# Altium project PCB_Project.PrjPcb
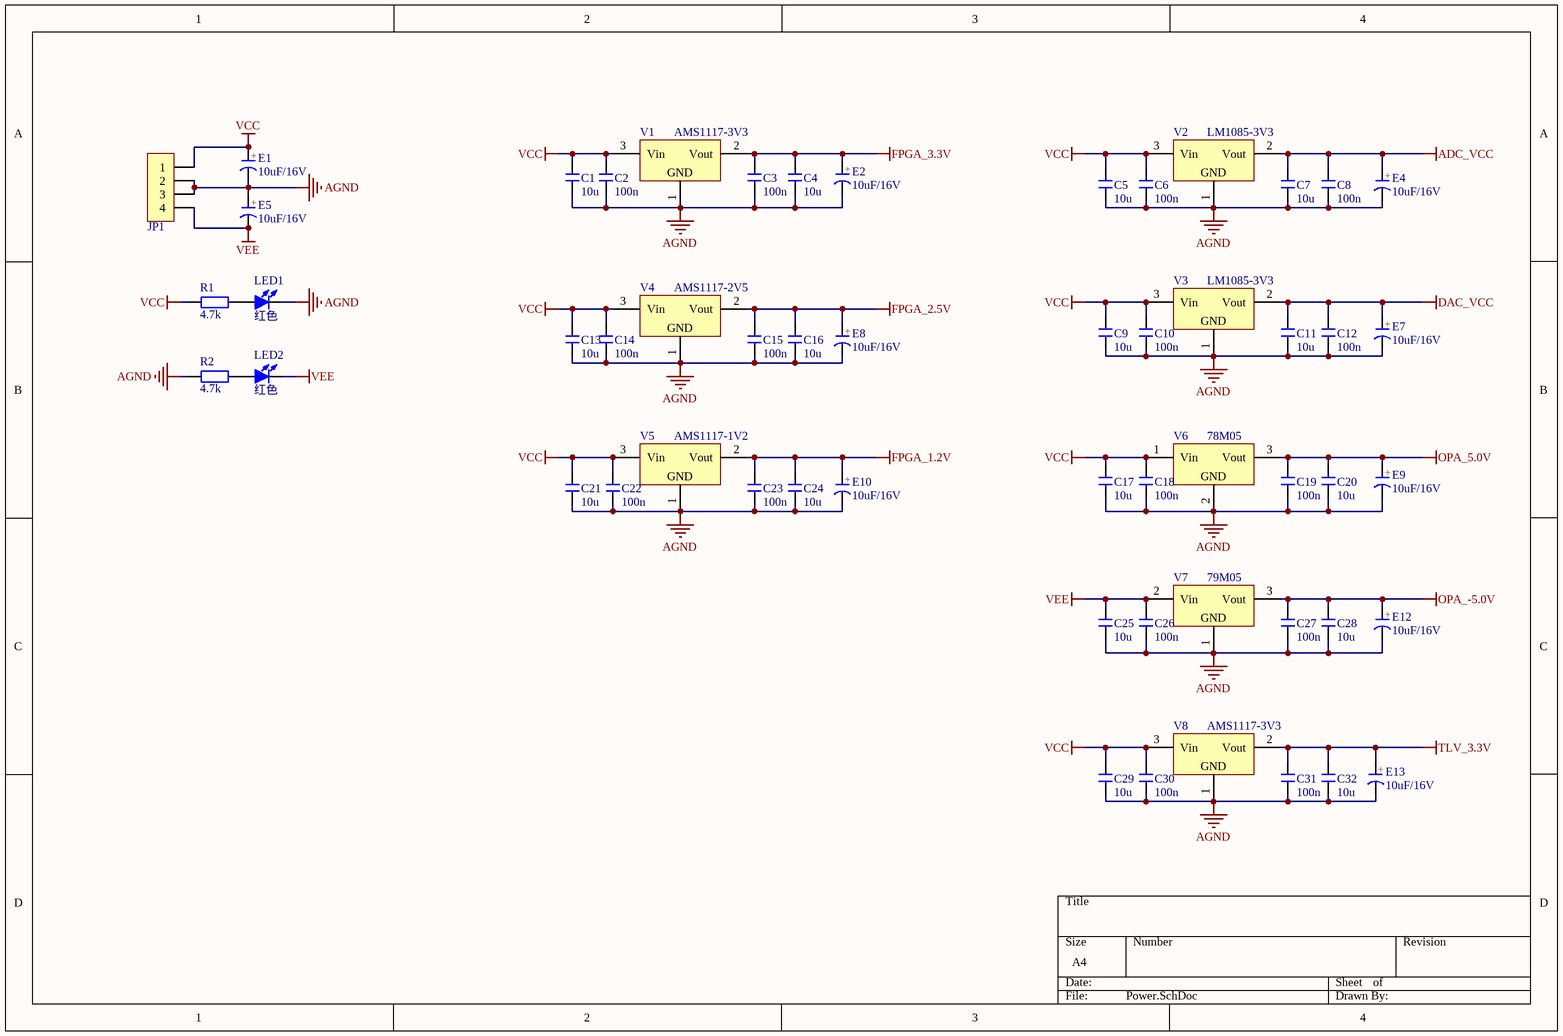
[diagram p0: Power.SchDoc]
5 sheets, 240 parts. Net scope: global (net labels, ports and power ports of the same name join across sheets).
Board file: PCB1.PcbDoc
Sheets:
  Power.SchDoc
  FPGA.SchDoc
  ADS5553.SchDoc
  DAC5672.SchDoc
  TLV3501.SchDoc

## Sheet Power.SchDoc
size A4

### Parts
C1  10u  [C 0805_M]
C2  100n  [C 0805_M]
C3  100n  [C 0805_M]
C4  10u  [C 0805_M]
C5  10u  [C 0805_M]
C6  100n  [C 0805_M]
C7  10u  [C 0805_M]
C8  100n  [C 0805_M]
C9  10u  [C 0805_M]
C10  100n  [C 0805_M]
C11  10u  [C 0805_M]
C12  100n  [C 0805_M]
C13  10u  [C 0805_M]
C14  100n  [C 0805_M]
C15  100n  [C 0805_M]
C16  10u  [C 0805_M]
C17  10u  [C 0805_M]
C18  100n  [C 0805_M]
C19  100n  [C 0805_M]
C20  10u  [C 0805_M]
C21  10u  [C 0805_M]
C22  100n  [C 0805_M]
C23  100n  [C 0805_M]
C24  10u  [C 0805_M]
C25  10u  [C 0805_M]
C26  100n  [C 0805_M]
C27  100n  [C 0805_M]
C28  10u  [C 0805_M]
C29  10u  [C 0805_M]
C30  100n  [C 0805_M]
C31  100n  [C 0805_M]
C32  10u  [C 0805_M]
E1  10uF/16V  [C 1210_M]
E2  10uF/16V  [C 1210_M]
E4  10uF/16V  [C 1210_M]
E5  10uF/16V  [C 1210_M]
E7  10uF/16V  [C 1210_M]
E8  10uF/16V  [C 1210_M]
E9  10uF/16V  [C 1210_M]
E10  10uF/16V  [C 1210_M]
E12  10uF/16V  [C 1210_M]
E13  10uF/16V  [C 1210_M]
JP1  HDR-1X4  [KF2510-LI-4P]  (value not drawn)
LED1  红色  [LED 0805G]
LED2  红色  [LED 0805G]
R1  4.7k  [R 0805_M]
R2  4.7k  [R 0805_M]
V1  AMS1117-3V3  [SOT223_M]
V2  LM1085-3V3  [TO263]
V3  LM1085-3V3  [TO263]
V4  AMS1117-2V5  [SOT223_M]
V5  AMS1117-1V2  [SOT223_M]
V6  78M05  [TO263]
V7  79M05  [TO263]
V8  AMS1117-3V3  [SOT223_M]

### Nets
ADC_VCC: C7.2 C8.2 E4.1(A) V2.2(Vout)
AGND: C1.1 C2.1 C3.1 C4.1 C5.1 C6.1 C7.1 C8.1 C9.1 C10.1 C11.1 C12.1 C13.1 C14.1 C15.1 C16.1 C17.1 C18.1 C19.1 C20.1 C21.1 C22.1 C23.1 C24.1 C25.1 C26.1 C27.1 C28.1 C29.1 C30.1 C31.1 C32.1 E1.2(K) E2.2(K) E4.2(K) E5.1(A) E7.2(K) E8.2(K) E9.2(K) E10.2(K) E12.2(K) E13.2(K) JP1.2 JP1.3 LED1.2(K) R2.1 V1.1(GND) V2.1(GND) V3.1(GND) V4.1(GND) V5.1(GND) V6.2(GND) V7.1(GND) V8.1(GND)
DAC_VCC: C11.2 C12.2 E7.1(A) V3.2(Vout)
FPGA_1.2V: C23.2 C24.2 E10.1(A) V5.2(Vout)
FPGA_2.5V: C15.2 C16.2 E8.1(A) V4.2(Vout)
FPGA_3.3V: C3.2 C4.2 E2.1(A) V1.2(Vout)
OPA_5.0V: C19.2 C20.2 E9.1(A) V6.3(Vout)
OPA_-5.0V: C27.2 C28.2 E12.1(A) V7.3(Vout)
TLV_3.3V: C31.2 C32.2 E13.1(A) V8.2(Vout)
VCC: C1.2 C2.2 C5.2 C6.2 C9.2 C10.2 C13.2 C14.2 C17.2 C18.2 C21.2 C22.2 C29.2 C30.2 E1.1(A) JP1.1 R1.1 V1.3(Vin) V2.3(Vin) V3.3(Vin) V4.3(Vin) V5.3(Vin) V6.1(Vin) V8.3(Vin)
VEE: C25.2 C26.2 E5.2(K) JP1.4 LED2.2(K) V7.2(Vin)
NetLED1_1: LED1.1(A) R1.2
NetLED2_1: LED2.1(A) R2.2

### Notes on the sheet
- (in symbol C-CAP) +

### Library data of the parts
C1-C32 = C: 无极性贴片电容; 版权归属: 源创客; BOM名称: 无极性贴片电容; 学习资源: www.ooocke.com
E1 E2 E4 E5 E7-E10 E12 E13 = C-CAP: 直插电解电容; 版权归属: 源创客; BOM名称: 直插电解电容; 学习资源: www.ooocke.com
JP1 = Header 4: 4P接插件; 版权归属: 源创客; BOM名称: 4P接插件; 学习资源: www.ooocke.com
LED1 LED2 = LED-SMD: 贴片LED; 版权归属: 源创客; BOM名称: 贴片LED; 学习资源: www.ooocke.com
R1 R2 = R: 贴片电阻; 版权归属: 源创客; BOM名称: 贴片电阻; 学习资源: www.ooocke.com
V1-V8 = AMS1117: 三端稳压芯片; BOM名称: 稳压芯片; 版权归属: 源创客; 学习资源: www.ooocke.com

## Sheet FPGA.SchDoc
size A3
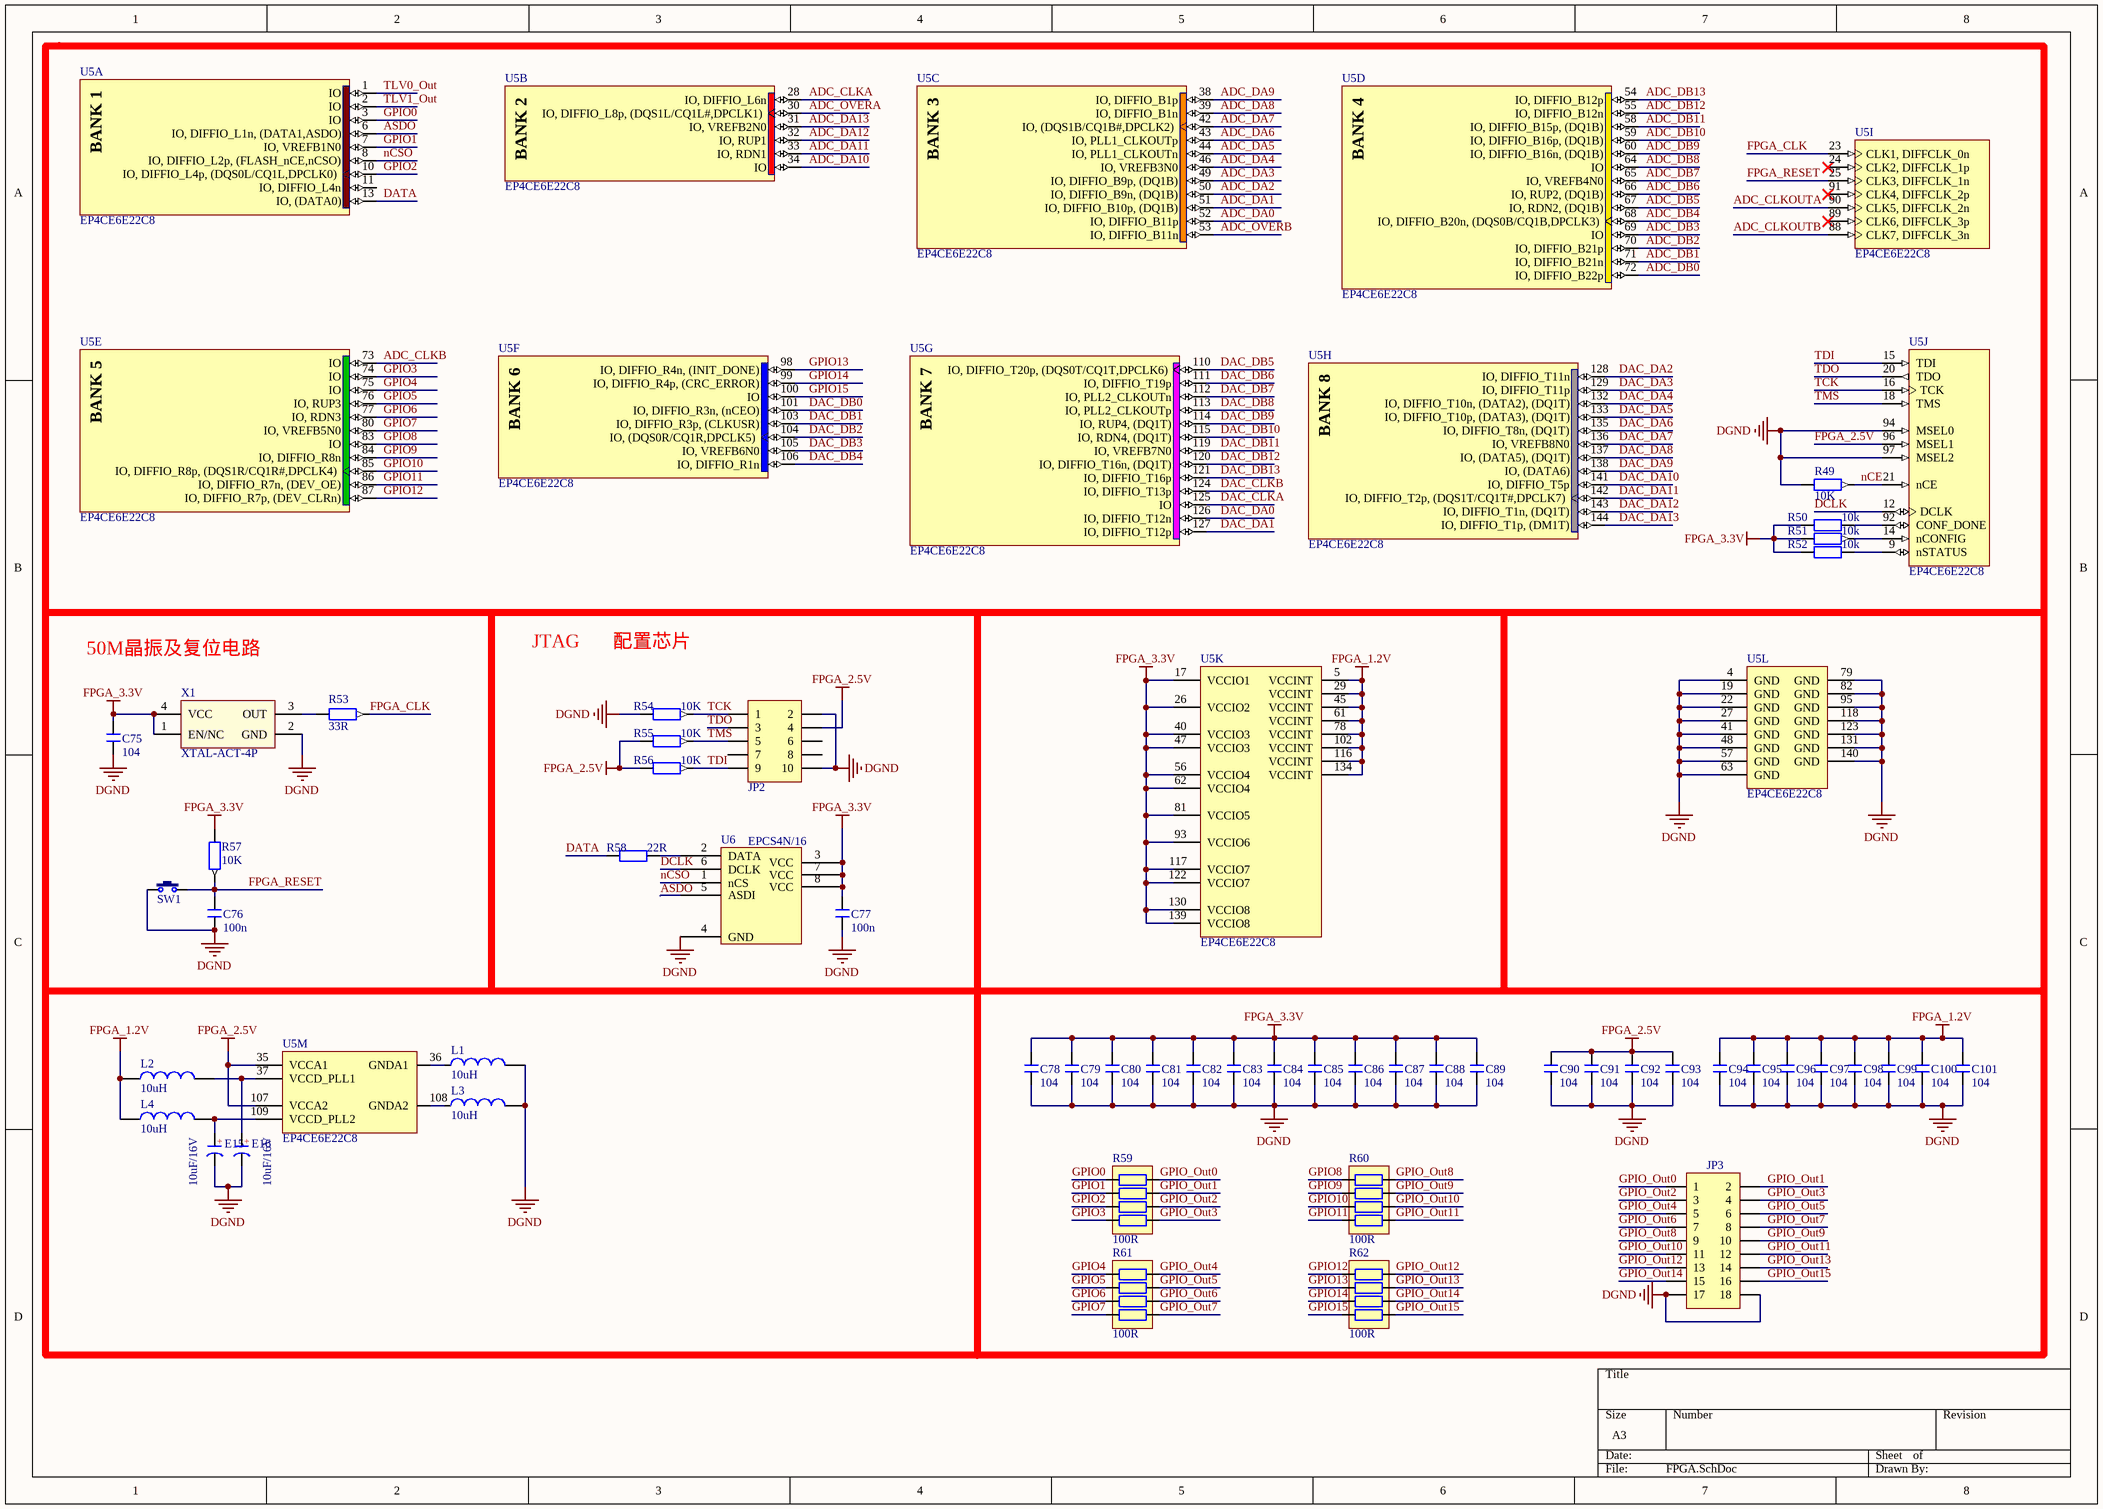
[diagram p1: FPGA.SchDoc]

### Parts
C75  104  [C 0805_M]
C76  100n  [C 0805_M]
C77  100n  [C 0805_M]
C78  104  [C 0805_M]
C79  104  [C 0805_M]
C80  104  [C 0805_M]
C81  104  [C 0805_M]
C82  104  [C 0805_M]
C83  104  [C 0805_M]
C84  104  [C 0805_M]
C85  104  [C 0805_M]
C86  104  [C 0805_M]
C87  104  [C 0805_M]
C88  104  [C 0805_M]
C89  104  [C 0805_M]
C90  104  [C 0805_M]
C91  104  [C 0805_M]
C92  104  [C 0805_M]
C93  104  [C 0805_M]
C94  104  [C 0805_M]
C95  104  [C 0805_M]
C96  104  [C 0805_M]
C97  104  [C 0805_M]
C98  104  [C 0805_M]
C99  104  [C 0805_M]
C100  104  [C 0805_M]
C101  104  [C 0805_M]
E15  10uF/16V  [C 1210_M]
E16  10uF/16V  [C 1210_M]
JP2  Header 5X2  [IDC2.54-LI-2x5P]  (value not drawn)
JP3  Header 9X2  [HDR2.54-LI-2x9P]  (value not drawn)
L1  10uH  [L 0805]
L2  10uH  [L 0805]
L3  10uH  [L 0805]
L4  10uH  [L 0805]
R49  10K  [R 0805_M]
R50  10k  [R 0805_M]
R51  10k  [R 0805_M]
R52  10k  [R 0805_M]
R53  33R  [R 0805_M]
R54  10K  [R 0805_M]
R55  10K  [R 0805_M]
R56  10K  [R 0805_M]
R57  10K  [R 0805_M]
R58  22R  [R 0805_M]
R59  100R  [RCA-8P4R-0603]
R60  100R  [RCA-8P4R-0603]
R61  100R  [RCA-8P4R-0603]
R62  100R  [RCA-8P4R-0603]
SW1  3x6x5  [TSW SMD-3*6*2.5]  (value not drawn)
U5  EP4CE6E22C8  [EQFP144_M]  (parts A,B,C,D,E,F,G,H,I,J,K,L,M of 13)
U6  EPCS4N/16  [SOP8_M]
X1  XTAL-ACT-4P  [OSC 7050-4P]

### Nets
DGND: C75.1 C76.1 C77.1 C78.1 C79.1 C80.1 C81.1 C82.1 C83.1 C84.1 C85.1 C86.1 C87.1 C88.1 C89.1 C90.1 C91.1 C92.1 C93.1 C94.1 C95.1 C96.1 C97.1 C98.1 C99.1 C100.1 C101.1 E15.2(K) E16.2(K) JP2.2 JP2.10 JP3.17 JP3.18 L1.2 L3.2 R49.1 R54.2 SW1.1 U5.4(GND) U5.19(GND) U5.22(GND) U5.27(GND) U5.41(GND) U5.48(GND) U5.57(GND) U5.63(GND) U5.79(GND) U5.82(GND) U5.94(MSEL0) U5.95(GND) U5.97(MSEL2) U5.118(GND) U5.123(GND) U5.131(GND) U5.140(GND) U6.4(GND) X1.2(GND)
FPGA_1.2V: C94.2 C95.2 C96.2 C97.2 C98.2 C99.2 C100.2 C101.2 L2.1 L4.1 U5.5(VCCINT) U5.29(VCCINT) U5.45(VCCINT) U5.61(VCCINT) U5.78(VCCINT) U5.102(VCCINT) U5.116(VCCINT) U5.134(VCCINT)
FPGA_2.5V: C90.2 C91.2 C92.2 C93.2 JP2.4 R55.2 R56.2 U5.35(VCCA1) U5.96(MSEL1) U5.107(VCCA2)
FPGA_3.3V: C75.2 C77.2 C78.2 C79.2 C80.2 C81.2 C82.2 C83.2 C84.2 C85.2 C86.2 C87.2 C88.2 C89.2 R50.1 R51.1 R52.1 R57.2 U5.17(VCCIO1) U5.26(VCCIO2) U5.40(VCCIO3) U5.47(VCCIO3) U5.56(VCCIO4) U5.62(VCCIO4) U5.81(VCCIO5) U5.93(VCCIO6) U5.117(VCCIO7) U5.122(VCCIO7) U5.130(VCCIO8) U5.139(VCCIO8) U6.3(VCC) U6.7(VCC) U6.8(VCC) X1.1(EN/NC) X1.4(VCC)
ADC_CLKA: U5.28(IO,_DIFFIO_L6n)
ADC_CLKB: U5.73(IO)
ADC_CLKOUTA: U5.90(CLK5,_DIFFCLK_2n)
ADC_CLKOUTB: U5.88(CLK7,_DIFFCLK_3n)
ADC_DA0: U5.52(IO,_DIFFIO_B11p)
ADC_DA1: U5.51(IO,_DIFFIO_B10p,_(DQ1B))
ADC_DA2: U5.50(IO,_DIFFIO_B9n,_(DQ1B))
ADC_DA3: U5.49(IO,_DIFFIO_B9p,_(DQ1B))
ADC_DA4: U5.46(IO,_VREFB3N0)
ADC_DA5: U5.44(IO,_PLL1_CLKOUTn)
ADC_DA6: U5.43(IO,_PLL1_CLKOUTp)
ADC_DA7: U5.42(IO,_(DQS1B/CQ1B#,DPCLK2))
ADC_DA8: U5.39(IO,_DIFFIO_B1n)
ADC_DA9: U5.38(IO,_DIFFIO_B1p)
ADC_DA10: U5.34(IO)
ADC_DA11: U5.33(IO,_RDN1)
ADC_DA12: U5.32(IO,_RUP1)
ADC_DA13: U5.31(IO,_VREFB2N0)
ADC_DB0: U5.72(IO,_DIFFIO_B22p)
ADC_DB1: U5.71(IO,_DIFFIO_B21n)
ADC_DB2: U5.70(IO,_DIFFIO_B21p)
ADC_DB3: U5.69(IO)
ADC_DB4: U5.68(IO,_DIFFIO_B20n,_(DQS0B/CQ1B,DPCLK3))
ADC_DB5: U5.67(IO,_RDN2,_(DQ1B))
ADC_DB6: U5.66(IO,_RUP2,_(DQ1B))
ADC_DB7: U5.65(IO,_VREFB4N0)
ADC_DB8: U5.64(IO)
ADC_DB9: U5.60(IO,_DIFFIO_B16n,_(DQ1B))
ADC_DB10: U5.59(IO,_DIFFIO_B16p,_(DQ1B))
ADC_DB11: U5.58(IO,_DIFFIO_B15p,_(DQ1B))
ADC_DB12: U5.55(IO,_DIFFIO_B12n)
ADC_DB13: U5.54(IO,_DIFFIO_B12p)
ADC_OVERA: U5.30(IO,_DIFFIO_L8p,_(DQS1L/CQ1L#,DPCLK1))
ADC_OVERB: U5.53(IO,_DIFFIO_B11n)
ASDO: U5.6(IO,_DIFFIO_L1n,_(DATA1,ASDO)) U6.5(ASDI)
DAC_CLKA: U5.125(IO)
DAC_CLKB: U5.124(IO,_DIFFIO_T13p)
DAC_DA0: U5.126(IO,_DIFFIO_T12n)
DAC_DA1: U5.127(IO,_DIFFIO_T12p)
DAC_DA2: U5.128(IO,_DIFFIO_T11n)
DAC_DA3: U5.129(IO,_DIFFIO_T11p)
DAC_DA4: U5.132(IO,_DIFFIO_T10n,_(DATA2),_(DQ1T))
DAC_DA5: U5.133(IO,_DIFFIO_T10p,_(DATA3),_(DQ1T))
DAC_DA6: U5.135(IO,_DIFFIO_T8n,_(DQ1T))
DAC_DA7: U5.136(IO,_VREFB8N0)
DAC_DA8: U5.137(IO,_(DATA5),_(DQ1T))
DAC_DA9: U5.138(IO,_(DATA6))
DAC_DA10: U5.141(IO,_DIFFIO_T5p)
DAC_DA11: U5.142(IO,_DIFFIO_T2p,_(DQS1T/CQ1T#,DPCLK7))
DAC_DA12: U5.143(IO,_DIFFIO_T1n,_(DQ1T))
DAC_DA13: U5.144(IO,_DIFFIO_T1p,_(DM1T))
DAC_DB0: U5.101(IO,_DIFFIO_R3n,_(nCEO))
DAC_DB1: U5.103(IO,_DIFFIO_R3p,_(CLKUSR))
DAC_DB2: U5.104(IO,_(DQS0R/CQ1R,DPCLK5))
DAC_DB3: U5.105(IO,_VREFB6N0)
DAC_DB4: U5.106(IO,_DIFFIO_R1n)
DAC_DB5: U5.110(IO,_DIFFIO_T20p,_(DQS0T/CQ1T,DPCLK6))
DAC_DB6: U5.111(IO,_DIFFIO_T19p)
DAC_DB7: U5.112(IO,_PLL2_CLKOUTn)
DAC_DB8: U5.113(IO,_PLL2_CLKOUTp)
DAC_DB9: U5.114(IO,_RUP4,_(DQ1T))
DAC_DB10: U5.115(IO,_RDN4,_(DQ1T))
DAC_DB11: U5.119(IO,_VREFB7N0)
DAC_DB12: U5.120(IO,_DIFFIO_T16n,_(DQ1T))
DAC_DB13: U5.121(IO,_DIFFIO_T16p)
DATA: R58.2 U5.13(IO,_(DATA0))
DCLK: U5.12(DCLK) U6.6(DCLK)
FPGA_CLK: R53.2 U5.23(CLK1,_DIFFCLK_0n)
FPGA_RESET: C76.2 R57.1 SW1.2 U5.25(CLK3,_DIFFCLK_1n)
GPIO0: R59.8 U5.3(IO)
GPIO1: R59.7 U5.7(IO,_VREFB1N0)
GPIO2: R59.6 U5.10(IO,_DIFFIO_L4p,_(DQS0L/CQ1L,DPCLK0))
GPIO3: R59.5 U5.74(IO)
GPIO4: R61.4 U5.75(IO)
GPIO5: R61.3 U5.76(IO,_RUP3)
GPIO6: R61.2 U5.77(IO,_RDN3)
GPIO7: R61.1 U5.80(IO,_VREFB5N0)
GPIO8: R60.8 U5.83(IO)
GPIO9: R60.7 U5.84(IO,_DIFFIO_R8n)
GPIO10: R60.6 U5.85(IO,_DIFFIO_R8p,_(DQS1R/CQ1R#,DPCLK4))
GPIO11: R60.5 U5.86(IO,_DIFFIO_R7n,_(DEV_OE))
GPIO12: R62.8 U5.87(IO,_DIFFIO_R7p,_(DEV_CLRn))
GPIO13: R62.7 U5.98(IO,_DIFFIO_R4n,_(INIT_DONE))
GPIO14: R62.6 U5.99(IO,_DIFFIO_R4p,_(CRC_ERROR))
GPIO15: R62.5 U5.100(IO)
GPIO_Out0: JP3.1 R59.1
GPIO_Out1: JP3.2 R59.2
GPIO_Out2: JP3.3 R59.3
GPIO_Out3: JP3.4 R59.4
GPIO_Out4: JP3.5 R61.5
GPIO_Out5: JP3.6 R61.6
GPIO_Out6: JP3.7 R61.7
GPIO_Out7: JP3.8 R61.8
GPIO_Out8: JP3.9 R60.1
GPIO_Out9: JP3.10 R60.2
GPIO_Out10: JP3.11 R60.3
GPIO_Out11: JP3.12 R60.4
GPIO_Out12: JP3.13 R62.1
GPIO_Out13: JP3.14 R62.2
GPIO_Out14: JP3.15 R62.3
GPIO_Out15: JP3.16 R62.4
nCE: R49.2 U5.21(nCE)
nCSO: U5.8(IO,_DIFFIO_L2p,_(FLASH_nCE,nCSO)) U6.1(nCS)
TCK: JP2.1 R54.1 U5.16(TCK)
TDI: JP2.9 R56.1 U5.15(TDI)
TDO: JP2.3 U5.20(TDO)
TLV0_Out: U5.1(IO)
TLV1_Out: U5.2(IO)
TMS: JP2.5 R55.1 U5.18(TMS)
NetE15_1: E15.1(A) L4.2 U5.109(VCCD_PLL2)
NetE16_1: E16.1(A) L2.2 U5.37(VCCD_PLL1)
NetL1_1: L1.1 U5.36(GNDA1)
NetL3_1: L3.1 U5.108(GNDA2)
NetR50_2: R50.2 U5.92(CONF_DONE)
NetR51_2: R51.2 U5.14(nCONFIG)
NetR52_2: R52.2 U5.9(nSTATUS)
NetR53_1: R53.1 X1.3(OUT)
NetR58_1: R58.1 U6.2(DATA)

Not connected (* = marked no-connect by the designer): JP2 6 7 8; U5 11(IO,_DIFFIO_L4n) 24(CLK2,_DIFFCLK_1p)* 89(CLK6,_DIFFCLK_3p)* 91(CLK4,_DIFFCLK_2p)*

### Notes on the sheet
- JTAG
- 配置芯片
- 50M晶振及复位电路
- (in symbol C-CAP) +
- (in symbol EP4CE6E22C8, part A) BANK 1
- (in symbol EP4CE6E22C8, part B) BANK 2
- (in symbol EP4CE6E22C8, part C) BANK 3
- (in symbol EP4CE6E22C8, part D) BANK 4
- (in symbol EP4CE6E22C8, part E) BANK 5
- (in symbol EP4CE6E22C8, part F) BANK 6
- (in symbol EP4CE6E22C8, part G) BANK 7
- (in symbol EP4CE6E22C8, part H) BANK 8

### Library data of the parts
C75-C101 = C: 无极性贴片电容; 版权归属: 源创客; BOM名称: 无极性贴片电容; 学习资源: www.ooocke.com
E15 E16 = C-CAP: 直插电解电容; 版权归属: 源创客; BOM名称: 直插电解电容; 学习资源: www.ooocke.com
JP2 = Header 5X2: 5*2P接插件; 版权归属: 源创客; BOM名称: 5*2P接插件; 学习资源: www.ooocke.com
JP3 = Header 9X2: 9*2P接插件; 版权归属: 源创客; BOM名称: 9*2P接插件; 学习资源: www.ooocke.com
L1-L4 = L: 小功率贴片电感; 版权归属: 源创客; BOM名称: 小功率贴片电感; 学习资源: www.ooocke.com
R49 = Res2: Resistor; Published: 8-Jun-2000; LatestRevisionDate: 17-Jul-2002; LatestRevisionNote: Re-released for DXP Platform.; PackageReference: AXIAL-0.4; Publisher: Altium Limited; PackageDescription: Axial Device, Thru-Hole; 2 Leads; 0.4 in Pin Spacing
R50-R58 = R: 贴片电阻; 版权归属: 源创客; BOM名称: 贴片电阻; 学习资源: www.ooocke.com
R59-R62 = R-8P4R: 贴片网络排阻; 版权归属: 源创客; BOM名称: 贴片网络排阻; 学习资源: www.ooocke.com
SW1 = TSW 3x6: 3x6轻触开关; 版权归属: 源创客; BOM名称: 3x6轻触开关; 学习资源: www.ooocke.com
U5 = EP4CE6E22C8: Cyclone IV Family FPGA, 2V Core, 91 I/O Pins, 2 PLLs, 144-Pin QFP, Speed Grade 8, Commercial Grade; Published: 3-May-2010; DatasheetVersion: ver1.2, Mar-2010; PackageVersion: ver16.0, Dec-2009; PackageReference: EQFP144; Publisher: Altium Limited; PackageDescription: 144-Pin Plastic Enhanced Quad Flat Pack (EQFP144) - Wire Bond; Supplier 1: Digi-Key; Supplier Part Number 1: EP4CE6E22C8-ND; Code_JEDEC: MS-026-BFB; ComponentLink1Description: Manufacturer Link; ComponentLink1URL: http://www.altera.com/; ComponentLink2Description: Handbook; ComponentLink2URL: http://www.altera.com/literature/hb/cyclone-iv/cyclone4-handbook.pdf; ComponentLink3Description: Pinout Specification; ComponentLink3URL: http://www.altera.com/literature/lit-dp.jsp?category=cyc%204&showspreadsheet=y; ComponentLink4Description: Packaging Specification; ComponentLink4URL: http://www.altera.com/literature/ds/dspkg.pdf
U6 = EPCS1SI8
X1 = XTAL-ACT-4P: 4脚有源晶振

## Sheet ADS5553.SchDoc
size A4
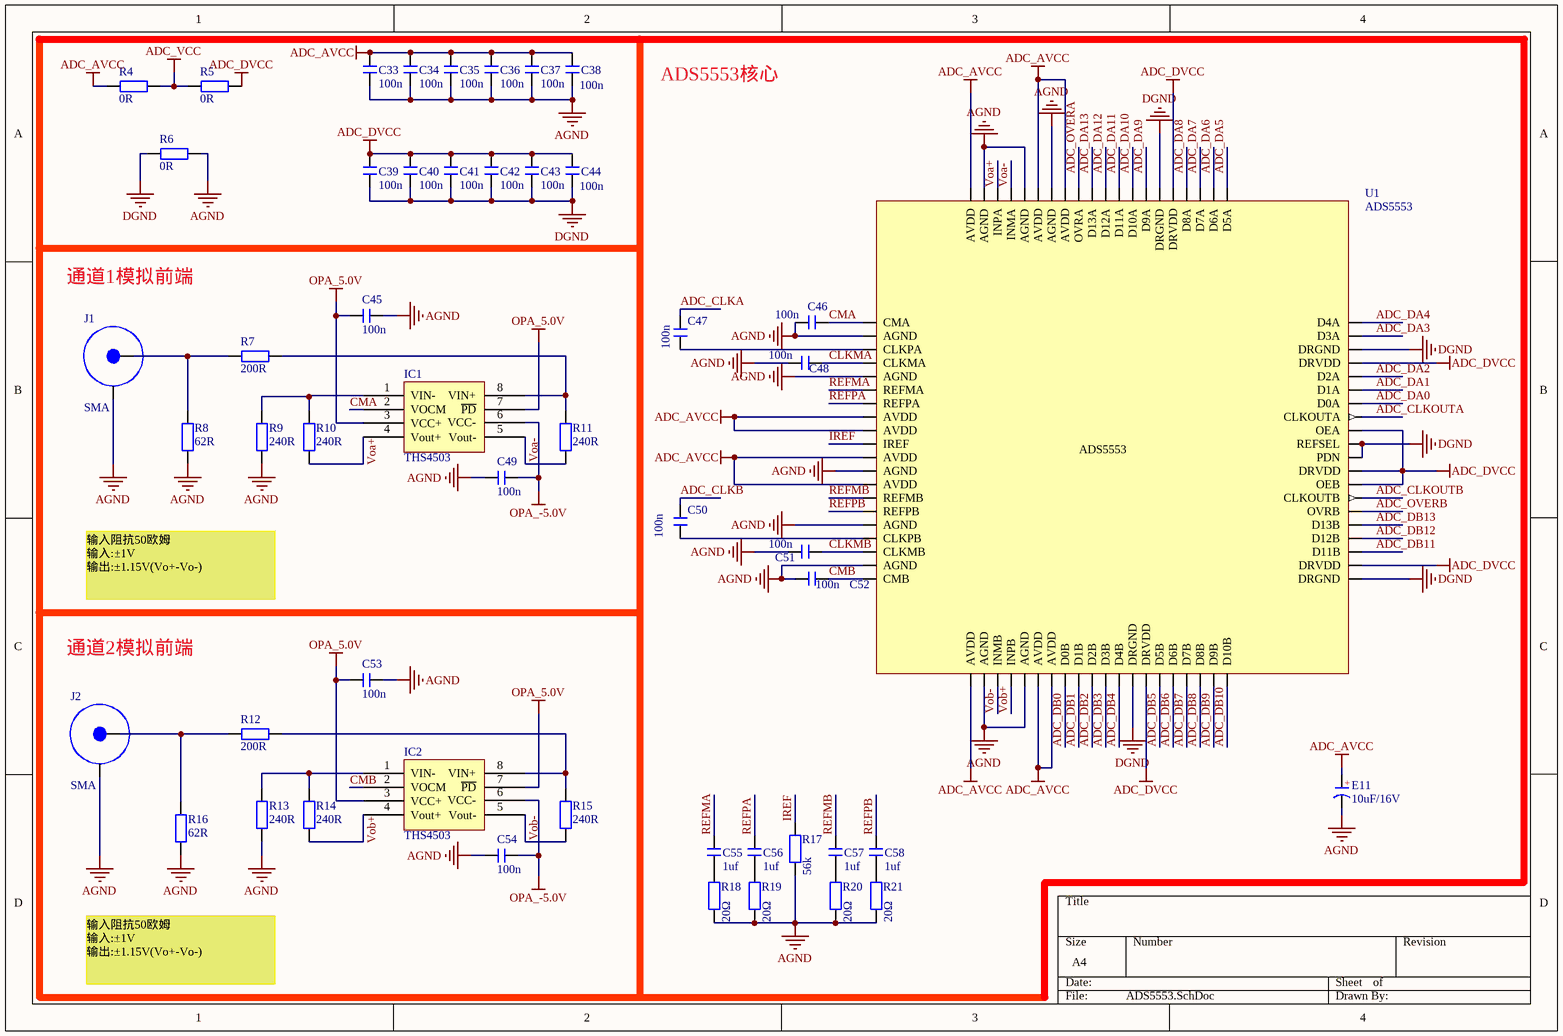
[diagram p2: ADS5553.SchDoc]

### Parts
C33  100n  [C 0805_M]
C34  100n  [C 0805_M]
C35  100n  [C 0805_M]
C36  100n  [C 0805_M]
C37  100n  [C 0805_M]
C38  100n  [C 0805_M]
C39  100n  [C 0805_M]
C40  100n  [C 0805_M]
C41  100n  [C 0805_M]
C42  100n  [C 0805_M]
C43  100n  [C 0805_M]
C44  100n  [C 0805_M]
C45  100n  [C 0805_M]
C46  100n  [C 0805_M]
C47  100n  [C 0805_M]
C48  100n  [C 0805_M]
C49  100n  [C 0805_M]
C50  100n  [C 0805_M]
C51  100n  [C 0805_M]
C52  100n  [C 0805_M]
C53  100n  [C 0805_M]
C54  100n  [C 0805_M]
C55  1uf  [C 0805_M]
C56  1uf  [C 0805_M]
C57  1uf  [C 0805_M]
C58  1uf  [C 0805_M]
E11  10uF/16V  [C 1210_M]
IC1  THS4503  [SOP8_M]
IC2  THS4503  [SOP8_M]
J1  SMA  [SMA_FR]
J2  SMA  [SMA_FR]
R4  0R  [R 0805_M]
R5  0R  [R 0805_M]
R6  0R  [R 1206_M]
R7  200R  [R 0805_M]
R8  62R  [R 0805_M]
R9  240R  [R 0805_M]
R10  240R  [R 0805_M]
R11  240R  [R 0805_M]
R12  200R  [R 0805_M]
R13  240R  [R 0805_M]
R14  240R  [R 0805_M]
R15  240R  [R 0805_M]
R16  62R  [R 0805_M]
R17  56k  [R 0805_M]
R18  20Ω  [R 0805_M]
R19  20Ω  [R 0805_M]
R20  20Ω  [R 0805_M]
R21  20Ω  [R 0805_M]
U1  ADS5553  [LQFP80 12x12_M]

### Nets
ADC_AVCC: C33.2 C34.2 C35.2 C36.2 C37.2 C38.2 E11.1(A) R4.2 U1.8(AVDD) U1.9(AVDD) U1.11(AVDD) U1.13(AVDD) U1.21(AVDD) U1.26(AVDD) U1.27(AVDD) U1.73(AVDD) U1.75(AVDD) U1.80(AVDD)
ADC_DVCC: C39.2 C40.2 C41.2 C42.2 C43.2 C44.2 R5.1 U1.34(DRVDD) U1.42(DRVDD) U1.48(OEB) U1.49(DRVDD) U1.52(OEA) U1.57(DRVDD) U1.65(DRVDD)
ADC_VCC: R4.1 R5.2
AGND: C33.1 C34.1 C35.1 C36.1 C37.1 C38.1 C45.2 C46.1 C48.1 C49.1 C51.1 C52.1 C53.2 C54.1 E11.2(K) J1.2 J2.2 R6.1 R8.2 R9.1 R13.1 R16.1 R17.1 R18.1 R19.1 R20.1 R21.1 U1.2(AGND) U1.5(AGND) U1.12(AGND) U1.16(AGND) U1.19(AGND) U1.22(AGND) U1.25(AGND) U1.74(AGND) U1.76(AGND) U1.79(AGND)
DGND: C39.1 C40.1 C41.1 C42.1 C43.1 C44.1 R6.2 U1.33(DRGND) U1.41(DRGND) U1.50(PDN) U1.51(REFSEL) U1.58(DRGND) U1.66(DRGND)
OPA_5.0V: C45.1 C53.1 IC1.3(VCC+) IC1.7(~{PD}) IC2.3(VCC+) IC2.7(~{PD})
OPA_-5.0V: C49.2 C54.2 IC1.6(VCC-) IC2.6(VCC-)
ADC_CLKA: C47.2
ADC_CLKB: C50.2
ADC_CLKOUTA: U1.53(CLKOUTA)
ADC_CLKOUTB: U1.47(CLKOUTB)
ADC_DA0: U1.54(D0A)
ADC_DA1: U1.55(D1A)
ADC_DA2: U1.56(D2A)
ADC_DA3: U1.59(D3A)
ADC_DA4: U1.60(D4A)
ADC_DA5: U1.61(D5A)
ADC_DA6: U1.62(D6A)
ADC_DA7: U1.63(D7A)
ADC_DA8: U1.64(D8A)
ADC_DA9: U1.67(D9A)
ADC_DA10: U1.68(D10A)
ADC_DA11: U1.69(D11A)
ADC_DA12: U1.70(D12A)
ADC_DA13: U1.71(D13A)
ADC_DB0: U1.28(D0B)
ADC_DB1: U1.29(D1B)
ADC_DB2: U1.30(D2B)
ADC_DB3: U1.31(D3B)
ADC_DB4: U1.32(D4B)
ADC_DB5: U1.35(D5B)
ADC_DB6: U1.36(D6B)
ADC_DB7: U1.37(D7B)
ADC_DB8: U1.38(D8B)
ADC_DB9: U1.39(D9B)
ADC_DB10: U1.40(D10B)
ADC_DB11: U1.43(D11B)
ADC_DB12: U1.44(D12B)
ADC_DB13: U1.45(D13B)
ADC_OVERA: U1.72(OVRA)
ADC_OVERB: U1.46(OVRB)
CLKMA: C48.2 U1.4(CLKMA)
CLKMB: C51.2 U1.18(CLKMB)
CMA: C46.2 IC1.2(VOCM) U1.1(CMA)
CMB: C52.2 IC2.2(VOCM) U1.20(CMB)
IREF: R17.2 U1.10(IREF)
REFMA: C55.2 U1.6(REFMA)
REFMB: C57.2 U1.14(REFMB)
REFPA: C56.2 U1.7(REFPA)
REFPB: C58.2 U1.15(REFPB)
Voa+: IC1.4(Vout+) R10.1 U1.78(INPA)
Voa-: IC1.5(Vout-) R11.1 U1.77(INMA)
Vob+: IC2.4(Vout+) R14.1 U1.24(INPB)
Vob-: IC2.5(Vout-) R15.1 U1.23(INMB)
NetC47_1: C47.1 U1.3(CLKPA)
NetC50_1: C50.1 U1.17(CLKPB)
NetC55_1: C55.1 R18.2
NetC56_1: C56.1 R19.2
NetC57_1: C57.1 R20.2
NetC58_1: C58.1 R21.2
NetIC1_1: IC1.1(VIN-) R9.2 R10.2
NetIC1_8: IC1.8(VIN+) R7.1 R11.2
NetIC2_1: IC2.1(VIN-) R13.2 R14.2
NetIC2_8: IC2.8(VIN+) R12.1 R15.2
NetJ1_1: J1.1 R7.2 R8.1
NetJ2_1: J2.1 R12.2 R16.2

### Notes on the sheet
- ADS5553核心
- 通道1模拟前端
- 通道2模拟前端
- 输入阻抗50欧姆
  输入:±1V
  输出:±1.15V(Vo+-Vo-)
- (in symbol C-CAP) +

### Library data of the parts
C33-C58 = C: 无极性贴片电容; 版权归属: 源创客; BOM名称: 无极性贴片电容; 学习资源: www.ooocke.com
E11 = C-CAP: 直插电解电容; 版权归属: 源创客; BOM名称: 直插电解电容; 学习资源: www.ooocke.com
IC1 IC2 = 24Cxx: 外置EEPROM; 版权归属: 源创客; BOM名称: 外置EEPROM; 学习资源: www.ooocke.com
R4-R21 = R: 贴片电阻; 版权归属: 源创客; BOM名称: 贴片电阻; 学习资源: www.ooocke.com

## Sheet DAC5672.SchDoc
size A4
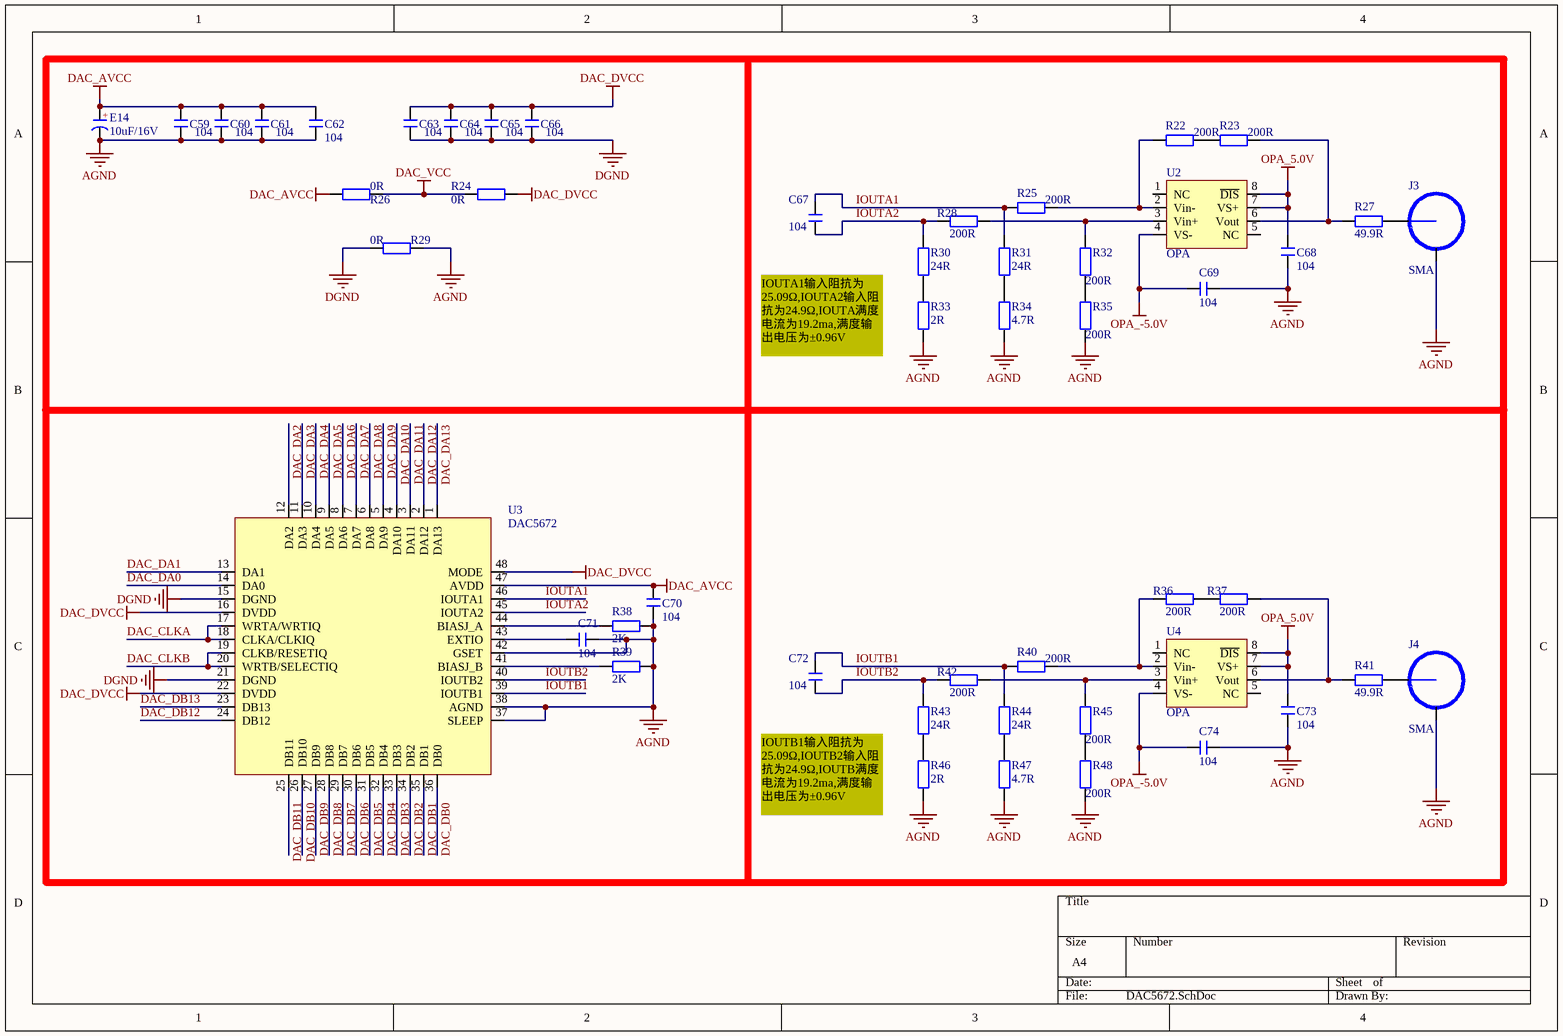
[diagram p3: DAC5672.SchDoc]

### Parts
C59  104  [C 0805_M]
C60  104  [C 0805_M]
C61  104  [C 0805_M]
C62  104  [C 0805_M]
C63  104  [C 0805_M]
C64  104  [C 0805_M]
C65  104  [C 0805_M]
C66  104  [C 0805_M]
C67  104  [C 0805_M]
C68  104  [C 0805_M]
C69  104  [C 0805_M]
C70  104  [C 0805_M]
C71  104  [C 0805_M]
C72  104  [C 0805_M]
C73  104  [C 0805_M]
C74  104  [C 0805_M]
E14  10uF/16V  [C 1210_M]
J3  SMA  [SMA_FR]
J4  SMA  [SMA_FR]
R22  200R  [R 0805_M]
R23  200R  [R 0805_M]
R24  0R  [R 0805_M]
R25  200R  [R 0805_M]
R26  0R  [R 0805_M]
R27  49.9R  [R 0805_M]
R28  200R  [R 0805_M]
R29  0R  [R 1206_M]
R30  24R  [R 0805_M]
R31  24R  [R 0805_M]
R32  200R  [R 0805_M]
R33  2R  [R 0805_M]
R34  4.7R  [R 0805_M]
R35  200R  [R 0805_M]
R36  200R  [R 0805_M]
R37  200R  [R 0805_M]
R38  2K  [R 0805_M]
R39  2K  [R 0805_M]
R40  200R  [R 0805_M]
R41  49.9R  [R 0805_M]
R42  200R  [R 0805_M]
R43  24R  [R 0805_M]
R44  24R  [R 0805_M]
R45  200R  [R 0805_M]
R46  2R  [R 0805_M]
R47  4.7R  [R 0805_M]
R48  200R  [R 0805_M]
U2  OPA  [SOP8_M]
U3  DAC5672  [TQFP48 7x7_M]
U4  OPA  [SOP8_M]

### Nets
AGND: C59.1 C60.1 C61.1 C62.1 C68.1 C69.1 C70.1 C71.2 C73.1 C74.1 E14.2(K) J3.2 J4.2 R29.2 R33.1 R34.2 R35.2 R38.2 R39.2 R46.1 R47.2 R48.2 U3.37(SLEEP) U3.38(AGND) U3.42(GSET)
DAC_AVCC: C59.2 C60.2 C61.2 C62.2 C70.2 E14.1(A) R26.1 U3.47(AVDD)
DAC_DVCC: C63.2 C64.2 C65.2 C66.2 R24.2 U3.16(DVDD) U3.22(DVDD) U3.48(MODE)
DAC_VCC: R24.1 R26.2
DGND: C63.1 C64.1 C65.1 C66.1 R29.1 U3.15(DGND) U3.21(DGND)
OPA_5.0V: C68.2 C73.2 U2.7(VS+) U2.8(~{DIS}) U4.7(VS+) U4.8(~{DIS})
OPA_-5.0V: C69.2 C74.2 U2.4(VS-) U4.4(VS-)
DAC_CLKA: U3.17(WRTA/WRTIQ) U3.18(CLKA/CLKIQ)
DAC_CLKB: U3.19(CLKB/RESETIQ) U3.20(WRTB/SELECTIQ)
DAC_DA0: U3.14(DA0)
DAC_DA1: U3.13(DA1)
DAC_DA2: U3.12(DA2)
DAC_DA3: U3.11(DA3)
DAC_DA4: U3.10(DA4)
DAC_DA5: U3.9(DA5)
DAC_DA6: U3.8(DA6)
DAC_DA7: U3.7(DA7)
DAC_DA8: U3.6(DA8)
DAC_DA9: U3.5(DA9)
DAC_DA10: U3.4(DA10)
DAC_DA11: U3.3(DA11)
DAC_DA12: U3.2(DA12)
DAC_DA13: U3.1(DA13)
DAC_DB0: U3.36(DB0)
DAC_DB1: U3.35(DB1)
DAC_DB2: U3.34(DB2)
DAC_DB3: U3.33(DB3)
DAC_DB4: U3.32(DB4)
DAC_DB5: U3.31(DB5)
DAC_DB6: U3.30(DB6)
DAC_DB7: U3.29(DB7)
DAC_DB8: U3.28(DB8)
DAC_DB9: U3.27(DB9)
DAC_DB10: U3.26(DB10)
DAC_DB11: U3.25(DB11)
DAC_DB12: U3.24(DB12)
DAC_DB13: U3.23(DB13)
IOUTA1: C67.1 R25.2 R31.1 U3.46(IOUTA1)
IOUTA2: C67.2 R28.2 R30.2 U3.45(IOUTA2)
IOUTB1: C72.1 R40.2 R44.1 U3.39(IOUTB1)
IOUTB2: C72.2 R42.2 R43.2 U3.40(IOUTB2)
NetC71_1: C71.1 U3.43(EXTIO)
NetJ3_1: J3.1 R27.2
NetJ4_1: J4.1 R41.2
NetR22_1: R22.1 R23.2
NetR22_2: R22.2 R25.1 U2.2(Vin-)
NetR23_1: R23.1 R27.1 U2.6(Vout)
NetR28_1: R28.1 R32.1 U2.3(Vin+)
NetR30_1: R30.1 R33.2
NetR31_2: R31.2 R34.1
NetR32_2: R32.2 R35.1
NetR36_1: R36.1 R37.2
NetR36_2: R36.2 R40.1 U4.2(Vin-)
NetR37_1: R37.1 R41.1 U4.6(Vout)
NetR38_1: R38.1 U3.44(BIASJ_A)
NetR39_1: R39.1 U3.41(BIASJ_B)
NetR42_1: R42.1 R45.2 U4.3(Vin+)
NetR43_1: R43.1 R46.2
NetR44_2: R44.2 R47.1
NetR45_1: R45.1 R48.1

Not connected (* = marked no-connect by the designer): U2 1(NC) 5(NC); U4 1(NC) 5(NC)

### Notes on the sheet
- IOUTA1输入阻抗为25.09Ω,IOUTA2输入阻抗为24.9Ω,IOUTA满度电流为19.2ma,满度输出电压为±0.96V
- IOUTB1输入阻抗为25.09Ω,IOUTB2输入阻抗为24.9Ω,IOUTB满度电流为19.2ma,满度输出电压为±0.96V
- (in symbol C-CAP) +

### Library data of the parts
C59-C74 = C: 无极性贴片电容; 版权归属: 源创客; BOM名称: 无极性贴片电容; 学习资源: www.ooocke.com
E14 = C-CAP: 直插电解电容; 版权归属: 源创客; BOM名称: 直插电解电容; 学习资源: www.ooocke.com
R22-R48 = R: 贴片电阻; 版权归属: 源创客; BOM名称: 贴片电阻; 学习资源: www.ooocke.com
U2 U4 = 单运放

## Sheet TLV3501.SchDoc
size A4
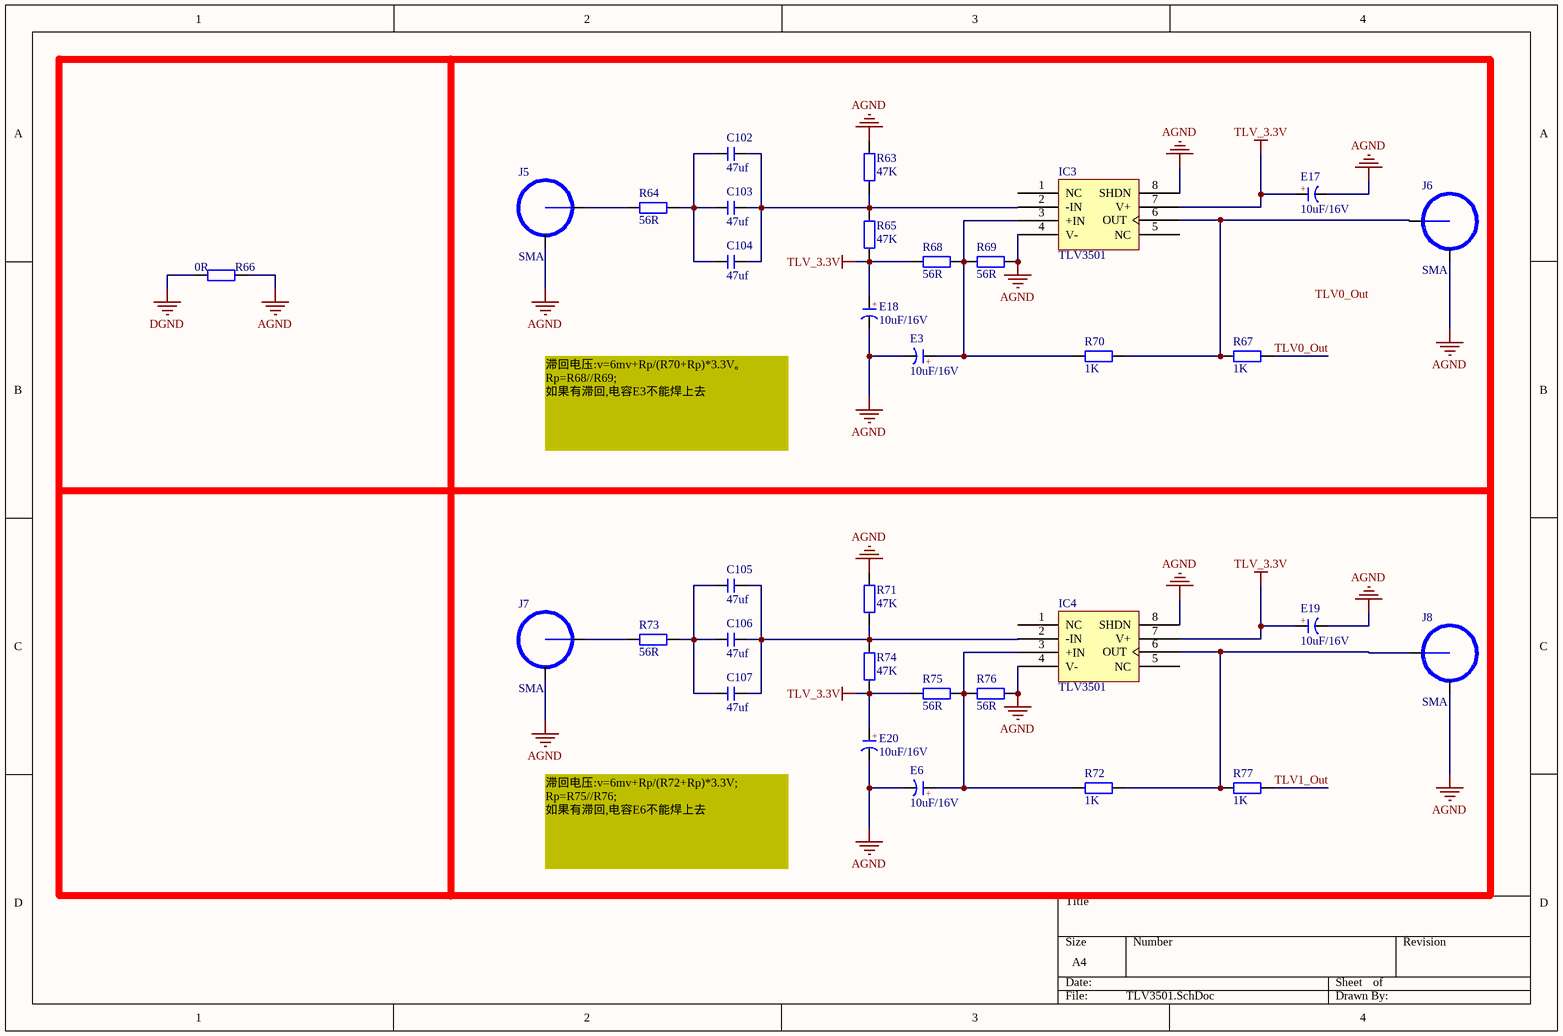
[diagram p4: TLV3501.SchDoc]

### Parts
C102  47uf  [C 0805_M]
C103  47uf  [C 0805_M]
C104  47uf  [C 0805_M]
C105  47uf  [C 0805_M]
C106  47uf  [C 0805_M]
C107  47uf  [C 0805_M]
E3  10uF/16V  [C 1210_M]
E6  10uF/16V  [C 1210_M]
E17  10uF/16V  [C 1210_M]
E18  10uF/16V  [C 1210_M]
E19  10uF/16V  [C 1210_M]
E20  10uF/16V  [C 1210_M]
IC3  TLV3501  [SOP8_M]
IC4  TLV3501  [SOP8_M]
J5  SMA  [SMA_FR]
J6  SMA  [SMA_FR]
J7  SMA  [SMA_FR]
J8  SMA  [SMA_FR]
R63  47K  [R 0805_M]
R64  56R  [R 0805_M]
R65  47K  [R 0805_M]
R66  0R  [R 0805_M]
R67  1K  [R 0805_L]
R68  56R  [R 0805_M]
R69  56R  [R 0805_M]
R70  1K  [R 0805_M]
R71  47K  [R 0805_M]
R72  1K  [R 0805_M]
R73  56R  [R 0805_M]
R74  47K  [R 0805_M]
R75  56R  [R 0805_M]
R76  56R  [R 0805_M]
R77  1K  [R 0805_L]

### Nets
AGND: E3.2(K) E6.2(K) E17.2(K) E18.2(K) E19.2(K) E20.2(K) IC3.4(V-) IC3.8(SHDN) IC4.4(V-) IC4.8(SHDN) J5.2 J6.2 J7.2 J8.2 R63.2 R66.2 R69.1 R71.2 R76.1
DGND: R66.1
TLV_3.3V: E17.1(A) E18.1(A) E19.1(A) E20.1(A) IC3.7(V+) IC4.7(V+) R65.1 R68.2 R74.1 R75.2
TLV0_Out: R67.2
TLV1_Out: R77.2
NetC102_1: C102.1 C103.1 C104.1 R64.1
NetC102_2: C102.2 C103.2 C104.2 IC3.2(-IN) R63.1 R65.2
NetC105_1: C105.1 C106.1 C107.1 R73.1
NetC105_2: C105.2 C106.2 C107.2 IC4.2(-IN) R71.1 R74.2
NetE3_1: E3.1(A) IC3.3(+IN) R68.1 R69.2 R70.2
NetE6_1: E6.1(A) IC4.3(+IN) R72.2 R75.1 R76.2
NetIC3_6: IC3.6(OUT) J6.1 R67.1 R70.1
NetIC4_6: IC4.6(OUT) J8.1 R72.1 R77.1
NetJ5_1: J5.1 R64.2
NetJ7_1: J7.1 R73.2

Not connected (* = marked no-connect by the designer): IC3 1(NC) 5(NC); IC4 1(NC) 5(NC)

### Notes on the sheet
- 滞回电压:v=6mv+Rp/(R70+Rp)*3.3V。
  Rp=R68//R69;
  如果有滞回,电容E3不能焊上去
- 滞回电压:v=6mv+Rp/(R72+Rp)*3.3V;
  Rp=R75//R76;
  如果有滞回,电容E6不能焊上去
- Labels drawn without touching a wire or pin: TLV0_Out
- (in symbol C-CAP) +

### Library data of the parts
C102-C107 = C: 无极性贴片电容; 版权归属: 源创客; BOM名称: 无极性贴片电容; 学习资源: www.ooocke.com
E3 E6 E17-E20 = C-CAP: 直插电解电容; 版权归属: 源创客; BOM名称: 直插电解电容; 学习资源: www.ooocke.com
IC3 IC4 = 24Cxx: 外置EEPROM; 版权归属: 源创客; BOM名称: 外置EEPROM; 学习资源: www.ooocke.com
R63-R77 = R: 贴片电阻; 版权归属: 源创客; BOM名称: 贴片电阻; 学习资源: www.ooocke.com

## Nets that join several sheets
ADC_VCC: Power (C7.2 C8.2 E4.1 V2.2), ADS5553 (R4.1 R5.2)
AGND: Power (54 pins), ADS5553 (37 pins), DAC5672 (25 pins), TLV3501 (19 pins)
DAC_VCC: Power (C11.2 C12.2 E7.1 V3.2), DAC5672 (R24.1 R26.2)
DGND: FPGA (57 pins), ADS5553 (13 pins), DAC5672 (7 pins), TLV3501 (R66.1)
FPGA_1.2V: Power (C23.2 C24.2 E10.1 V5.2), FPGA (18 pins)
FPGA_2.5V: Power (C15.2 C16.2 E8.1 V4.2), FPGA (10 pins)
FPGA_3.3V: Power (C3.2 C4.2 E2.1 V1.2), FPGA (35 pins)
OPA_5.0V: Power (C19.2 C20.2 E9.1 V6.3), ADS5553 (6 pins), DAC5672 (6 pins)
OPA_-5.0V: Power (C27.2 C28.2 E12.1 V7.3), ADS5553 (C49.2 C54.2 IC1.6 IC2.6), DAC5672 (C69.2 C74.2 U2.4 U4.4)
TLV_3.3V: Power (C31.2 C32.2 E13.1 V8.2), TLV3501 (10 pins)
ADC_CLKA: FPGA (U5.28), ADS5553 (C47.2)
ADC_CLKB: FPGA (U5.73), ADS5553 (C50.2)
ADC_CLKOUTA: FPGA (U5.90), ADS5553 (U1.53)
ADC_CLKOUTB: FPGA (U5.88), ADS5553 (U1.47)
ADC_DA0: FPGA (U5.52), ADS5553 (U1.54)
ADC_DA1: FPGA (U5.51), ADS5553 (U1.55)
ADC_DA2: FPGA (U5.50), ADS5553 (U1.56)
ADC_DA3: FPGA (U5.49), ADS5553 (U1.59)
ADC_DA4: FPGA (U5.46), ADS5553 (U1.60)
ADC_DA5: FPGA (U5.44), ADS5553 (U1.61)
ADC_DA6: FPGA (U5.43), ADS5553 (U1.62)
ADC_DA7: FPGA (U5.42), ADS5553 (U1.63)
ADC_DA8: FPGA (U5.39), ADS5553 (U1.64)
ADC_DA9: FPGA (U5.38), ADS5553 (U1.67)
ADC_DA10: FPGA (U5.34), ADS5553 (U1.68)
ADC_DA11: FPGA (U5.33), ADS5553 (U1.69)
ADC_DA12: FPGA (U5.32), ADS5553 (U1.70)
ADC_DA13: FPGA (U5.31), ADS5553 (U1.71)
ADC_DB0: FPGA (U5.72), ADS5553 (U1.28)
ADC_DB1: FPGA (U5.71), ADS5553 (U1.29)
ADC_DB2: FPGA (U5.70), ADS5553 (U1.30)
ADC_DB3: FPGA (U5.69), ADS5553 (U1.31)
ADC_DB4: FPGA (U5.68), ADS5553 (U1.32)
ADC_DB5: FPGA (U5.67), ADS5553 (U1.35)
ADC_DB6: FPGA (U5.66), ADS5553 (U1.36)
ADC_DB7: FPGA (U5.65), ADS5553 (U1.37)
ADC_DB8: FPGA (U5.64), ADS5553 (U1.38)
ADC_DB9: FPGA (U5.60), ADS5553 (U1.39)
ADC_DB10: FPGA (U5.59), ADS5553 (U1.40)
ADC_DB11: FPGA (U5.58), ADS5553 (U1.43)
ADC_DB12: FPGA (U5.55), ADS5553 (U1.44)
ADC_DB13: FPGA (U5.54), ADS5553 (U1.45)
ADC_OVERA: FPGA (U5.30), ADS5553 (U1.72)
ADC_OVERB: FPGA (U5.53), ADS5553 (U1.46)
DAC_CLKA: FPGA (U5.125), DAC5672 (U3.17 U3.18)
DAC_CLKB: FPGA (U5.124), DAC5672 (U3.19 U3.20)
DAC_DA0: FPGA (U5.126), DAC5672 (U3.14)
DAC_DA1: FPGA (U5.127), DAC5672 (U3.13)
DAC_DA2: FPGA (U5.128), DAC5672 (U3.12)
DAC_DA3: FPGA (U5.129), DAC5672 (U3.11)
DAC_DA4: FPGA (U5.132), DAC5672 (U3.10)
DAC_DA5: FPGA (U5.133), DAC5672 (U3.9)
DAC_DA6: FPGA (U5.135), DAC5672 (U3.8)
DAC_DA7: FPGA (U5.136), DAC5672 (U3.7)
DAC_DA8: FPGA (U5.137), DAC5672 (U3.6)
DAC_DA9: FPGA (U5.138), DAC5672 (U3.5)
DAC_DA10: FPGA (U5.141), DAC5672 (U3.4)
DAC_DA11: FPGA (U5.142), DAC5672 (U3.3)
DAC_DA12: FPGA (U5.143), DAC5672 (U3.2)
DAC_DA13: FPGA (U5.144), DAC5672 (U3.1)
DAC_DB0: FPGA (U5.101), DAC5672 (U3.36)
DAC_DB1: FPGA (U5.103), DAC5672 (U3.35)
DAC_DB2: FPGA (U5.104), DAC5672 (U3.34)
DAC_DB3: FPGA (U5.105), DAC5672 (U3.33)
DAC_DB4: FPGA (U5.106), DAC5672 (U3.32)
DAC_DB5: FPGA (U5.110), DAC5672 (U3.31)
DAC_DB6: FPGA (U5.111), DAC5672 (U3.30)
DAC_DB7: FPGA (U5.112), DAC5672 (U3.29)
DAC_DB8: FPGA (U5.113), DAC5672 (U3.28)
DAC_DB9: FPGA (U5.114), DAC5672 (U3.27)
DAC_DB10: FPGA (U5.115), DAC5672 (U3.26)
DAC_DB11: FPGA (U5.119), DAC5672 (U3.25)
DAC_DB12: FPGA (U5.120), DAC5672 (U3.24)
DAC_DB13: FPGA (U5.121), DAC5672 (U3.23)
TLV0_Out: FPGA (U5.1), TLV3501 (R67.2)
TLV1_Out: FPGA (U5.2), TLV3501 (R77.2)